# EAGLE schematic rtcv2 (EAGLE 9.5.1)
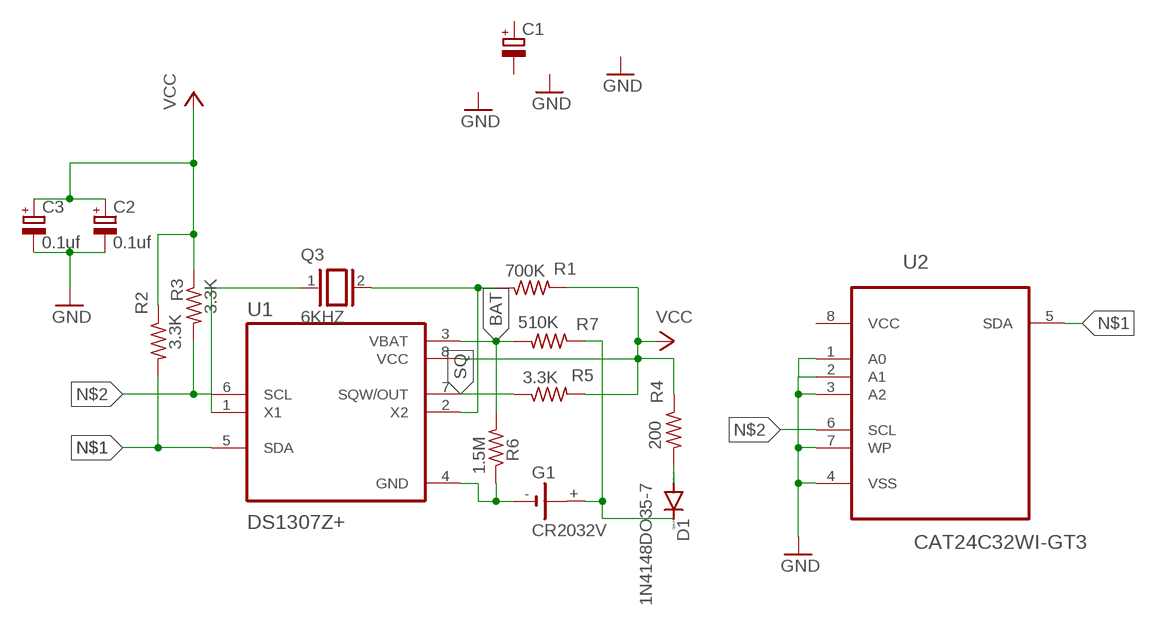
[diagram p0: schematic, sheet 1]

## Parts
C1  CPOL-EUB/3528-21W  [B/3528-21W]
C2  0.1uf  CPOL-EUB/3528-21W  [B/3528-21W]
C3  0.1uf  CPOL-EUB/3528-21W  [B/3528-21W]
D1  1N4148DO35-7  [DO35-7]
G1  CR2032V  [CR2032V]
Q3  6KHZ  XTAL/S  [QS]
R1  700K  R-US_R0603  [R0603]
R2  3.3K  R-US_R0603  [R0603]
R3  3.3K  R-US_R0603  [R0603]
R4  200  R-US_R0603  [R0603]
R5  3.3K  R-US_R0603  [R0603]
R6  1.5M  R-US_R0603  [R0603]
R7  510K  R-US_R0603  [R0603]
U1  DS1307Z+  [SOIC127P600X175-8N]
U2  CAT24C32WI-GT3  [SOIC127P600X175-8N]

## Nets
BAT: R6.2 R7.2 U1.3(VBAT)
GND: C2.- C3.- U2.1(A0) U2.2(A1) U2.3(A2) U2.4(VSS) U2.7(WP)
N$1: U2.5(SDA)
N$2: U2.6(SCL)
N$3: R2.2 U1.5(SDA)
N$4: R3.2 U1.6(SCL)
N$5: G1.- R6.1 U1.4(GND)
N$6: Q3.1 U1.1(X1)
N$7: D1.A R4.2
N$8: Q3.2 R1.1 U1.2(X2)
N$9: D1.C G1.+ R7.1
SQ: R5.1 U1.7(SQW/OUT)
VCC: C2.+ C3.+ R1.2 R2.1 R3.1 R4.1 R5.2 U1.8(VCC)
Unconnected: C1.+ C1.- G1.+@1(+)

## Power pins joined to a net without a drawn wire
VCC: U2.8(VCC)

## Library data of the parts
C1-C3 = rcl:CPOL-EU: POLARIZED CAPACITOR, European symbol; SPICEPREFIX: C
D1 = diode:1N4148: DIODE high speed (Philips)
G1 = battery:CR2032V: LI BATTERY Varta
Q3 = special:XTAL/S: CRYSTAL
R1-R7 = rcl:R-US_: RESISTOR, American symbol; SPICEPREFIX: R
U1 = DS1307Z_:DS1307Z+; AVAILABILITY: Unavailable; DESCRIPTION: Real Time Clock _RTC_ IC Clock/Calendar 56B I²C, 2-Wire Serial 8-SOIC _0.154, 3.90mm Width_; MF: Maxim Integrated; MP: DS1307Z; PACKAGE: SO-8 Maxim Integrated; PRICE: None
U2 = CAT24C32WI-GT3:CAT24C32WI-GT3: 32-Kb I2C CMOS Serial EEPROM; AVAILABILITY: Unavailable; DESCRIPTION: EEPROM Memory IC 32Kb _4K x 8_ I²C 1MHz 400ns 8-SOIC; MF: ON; MP: CAT24C32WI-GT3; PACKAGE: SOIC-8 ON; PRICE: None